# Altium schematic sheet PCB_mezzanine_clock_template.SchDoc: ADC/DAC mezzanine
size 420 x 297 mm; Author: G.K.; CompanyName: WUT; DrawnBy: G.K.; Organization: CERN; Address1: Warsaw Univeristy of Technology; Address2: Nowowiejska 15/19; Revision: -; SheetNumber: -; SheetTotal: -; EDA_Number: ARTIQ; Projet: ADC/DAC MEZZANINE; ModifiedBy: -; CreateDate: XX/XX/XXXX; CheckedDate: -; Title2: Top entity; DivGrp: ISE; Designer: G.K.; ModifiedDate: -; ProjectName: ADC/DAC MEZZANINE
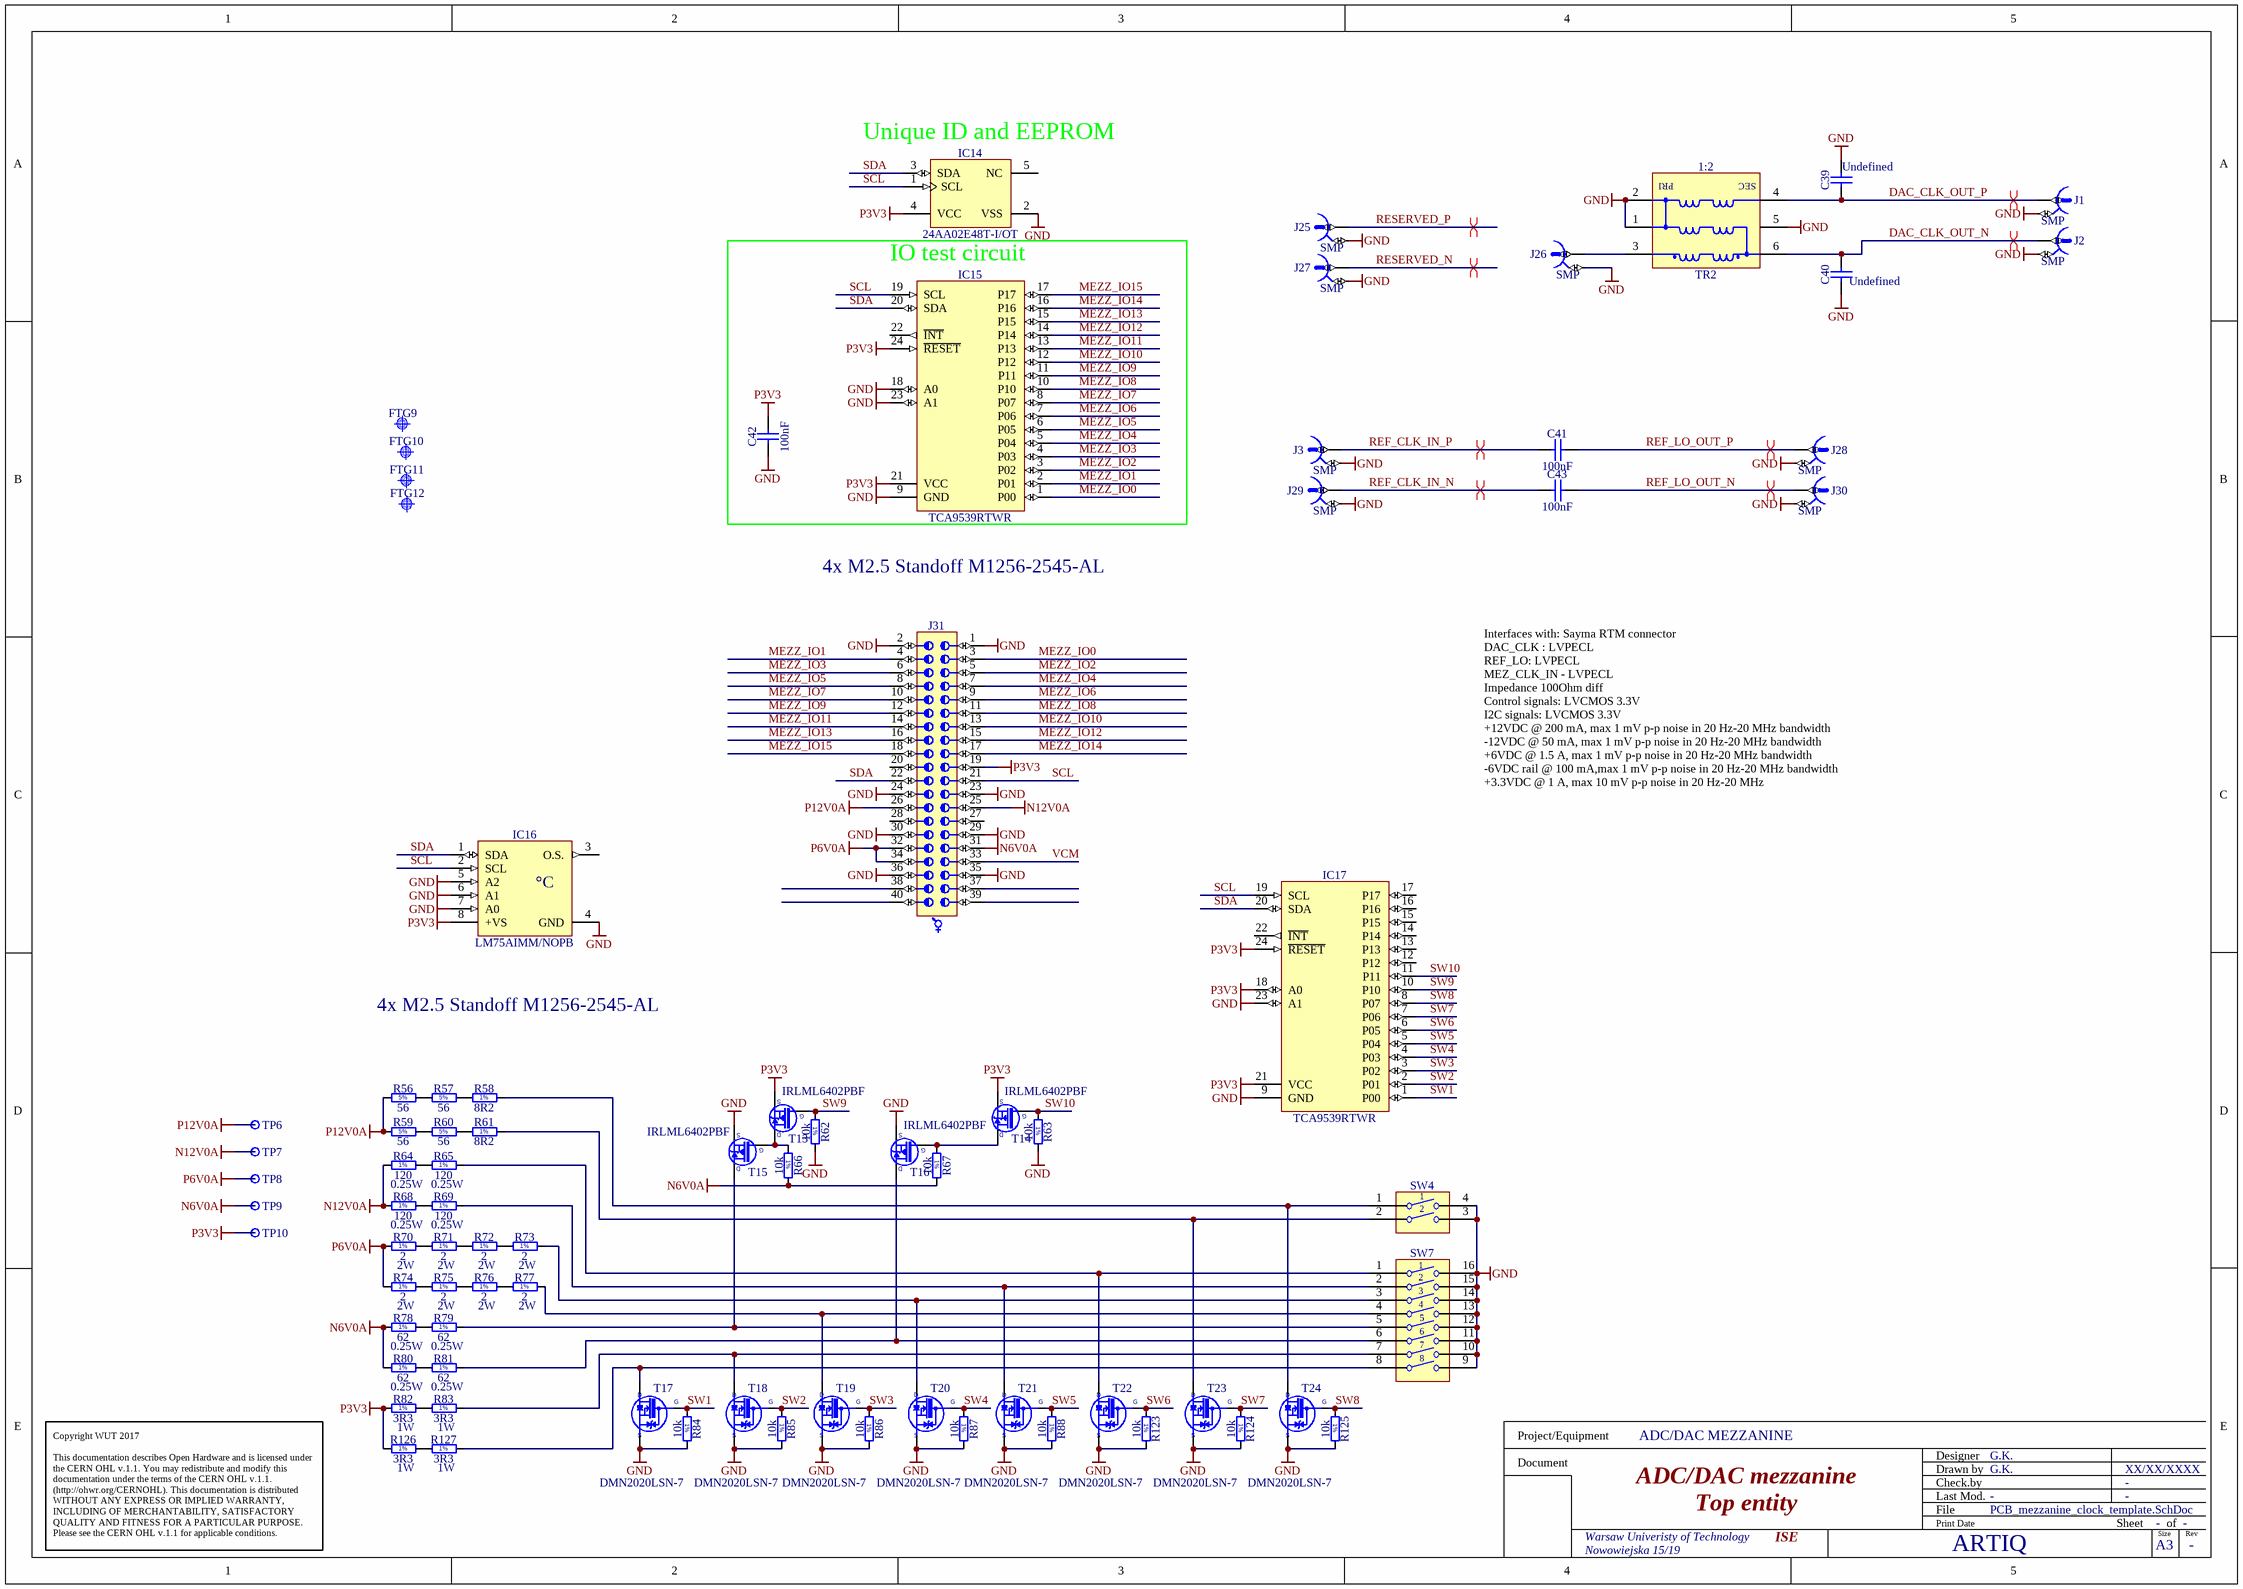
[diagram p0: PCB_mezzanine_clock_template.SchDoc]

## Parts
C39  Undefined  [CAPC1005X55N]
C40  Undefined  [CAPC1005X55N]
C41  100nF  [CAPC1005X55N]
C42  100nF  [CAPC1005X55N]
C43  100nF  [CAPC1005X55N]
FTG9  Use only in PCB  [FIDUCIAL_TOP_C100-200]  (value not drawn)
FTG10  Use only in PCB  [FIDUCIAL_TOP_S100-200]  (value not drawn)
FTG11  Use only in PCB  [FIDUCIAL_TOP_S200-400]  (value not drawn)
FTG12  Use only in PCB  [FIDUCIAL_TOP_S100-200]  (value not drawn)
IC14  24AA02E48T-I/OT  [SOT95P280X145-5N]
IC15  TCA9539RTWR  [QFN50P400X400X80-25N-S255]
IC16  LM75AIMM/NOPB  [SOP65P490X109-8N]
IC17  TCA9539RTWR  [QFN50P400X400X80-25N-S255]
J1  SMP  [MOLEX_85305-0232]
J2  SMP  [MOLEX_85305-0232]
J3  SMP  [MOLEX_85305-0232]
J25  SMP  [MOLEX_85305-0232]
J26  SMP  [MOLEX_73415-3591]
J27  SMP  [MOLEX_85305-0232]
J28  SMP  [MOLEX_85305-0232]
J29  SMP  [MOLEX_85305-0232]
J30  SMP  [MOLEX_85305-0232]
J31  (no value)  [SAMTEC_LSS-120-02-L-DV-A]
R56  56  [RESC6331X70N]
R57  56  [RESC6331X70N]
R58  8R2  [RESC3216X65N]
R59  56  [RESC6331X70N]
R60  56  [RESC6331X70N]
R61  8R2  [RESC3216X65N]
R62  10k  [RESC1005X40N]
R63  10k  [RESC1005X40N]
R64  120  Power: 0.25W  [RESC3216X65N]
R65  120  Power: 0.25W  [RESC3216X65N]
R66  10k  [RESC1005X40N]
R67  10k  [RESC1005X40N]
R68  120  Power: 0.25W  [RESC3216X65N]
R69  120  Power: 0.25W  [RESC3216X65N]
R70  2  Power: 2W  [RESM11670X449N]
R71  2  Power: 2W  [RESM11670X449N]
R72  2  Power: 2W  [RESM11670X449N]
R73  2  Power: 2W  [RESM11670X449N]
R74  2  Power: 2W  [RESM11670X449N]
R75  2  Power: 2W  [RESM11670X449N]
R76  2  Power: 2W  [RESM11670X449N]
R77  2  Power: 2W  [RESM11670X449N]
R78  62  Power: 0.25W  [RESC3216X65N]
R79  62  Power: 0.25W  [RESC3216X65N]
R80  62  Power: 0.25W  [RESC3216X65N]
R81  62  Power: 0.25W  [RESC3216X65N]
R82  3R3  Power: 1W  [RESC6331X70N]
R83  3R3  Power: 1W  [RESC6331X70N]
R84  10k  [RESC1005X40N]
R85  10k  [RESC1005X40N]
R86  10k  [RESC1005X40N]
R87  10k  [RESC1005X40N]
R88  10k  [RESC1005X40N]
R123  10k  [RESC1005X40N]
R124  10k  [RESC1005X40N]
R125  10k  [RESC1005X40N]
R126  3R3  Power: 1W  [RESC6331X70N]
R127  3R3  Power: 1W  [RESC6331X70N]
SW4  Switch  [SW_OMRON_A6S-2102-H]  (value not drawn)
SW7  Switch  [SW_OMRON_A6S-8102-H]  (value not drawn)
T13  IRLML6402PBF  [SOT95P237X112-3N]
T14  IRLML6402PBF  [SOT95P237X112-3N]
T15  IRLML6402PBF  [SOT95P237X112-3N]
T16  IRLML6402PBF  [SOT95P237X112-3N]
T17  DMN2020LSN-7  [SOT95P285X140-3N]
T18  DMN2020LSN-7  [SOT95P285X140-3N]
T19  DMN2020LSN-7  [SOT95P285X140-3N]
T20  DMN2020LSN-7  [SOT95P285X140-3N]
T21  DMN2020LSN-7  [SOT95P285X140-3N]
T22  DMN2020LSN-7  [SOT95P285X140-3N]
T23  DMN2020LSN-7  [SOT95P285X140-3N]
T24  DMN2020LSN-7  [SOT95P285X140-3N]
TP6  Test Point  [TPS127]  (value not drawn)
TP7  Test Point  [TPS127]  (value not drawn)
TP8  Test Point  [TPS127]  (value not drawn)
TP9  Test Point  [TPS127]  (value not drawn)
TP10  Test Point  [TPS127]  (value not drawn)
TR2  1:2  [XFMR_MINI-CIRCUITS_DB1627]

## Blocks framed on the sheet
IO test circuit: C42 IC15

## Nets
GND: C39.2 C40.1 C42.1 IC14.2(VSS) IC15.9(GND) IC15.18(A0) IC15.23(A1) IC16.4(GND) IC16.5(A2) IC16.6(A1) IC16.7(A0) IC17.9(GND) IC17.23(A1) J1.2 J2.2 J3.2 J25.2 J26.2 J27.2 J28.2 J29.2 J30.2 J31.1 J31.2 J31.23 J31.24 J31.29 J31.30 J31.35 J31.36 R62.2 R63.2 R84.2 R85.2 R86.2 R87.2 R88.2 R123.2 R124.2 R125.2 SW4.3 SW4.4 SW7.9 SW7.10 SW7.11 SW7.12 SW7.13 SW7.14 SW7.15 SW7.16 T15.2(S) T16.2(S) T17.2(S) T18.2(S) T19.2(S) T20.2(S) T21.2(S) T22.2(S) T23.2(S) T24.2(S) TR2.1(P1) TR2.2(P1) TR2.5(NC)
N6V0A: J31.31 R66.2 R67.2 R78.1 R80.1 TP9.1
N12V0A: J31.25 R64.1 R68.1 TP7.1
P3V3: C42.2 IC14.4(VCC) IC15.21(VCC) IC15.24(~{RESET}) IC16.8(+VS) IC17.18(A0) IC17.21(VCC) IC17.24(~{RESET}) J31.19 R82.1 R126.1 T13.2(S) T14.2(S) TP10.1
P6V0A: J31.32 J31.34 R70.1 R74.1 TP8.1
P12V0A: J31.26 R56.1 R59.1 TP6.1
DAC_CLK_OUT_N: C40.2 J2.1 TR2.6(S1)
DAC_CLK_OUT_P: C39.1 J1.1 TR2.4(S1)
MEZZ_IO0: IC15.1(P00) J31.3
MEZZ_IO1: IC15.2(P01) J31.4
MEZZ_IO2: IC15.3(P02) J31.5
MEZZ_IO3: IC15.4(P03) J31.6
MEZZ_IO4: IC15.5(P04) J31.7
MEZZ_IO5: IC15.6(P05) J31.8
MEZZ_IO6: IC15.7(P06) J31.9
MEZZ_IO7: IC15.8(P07) J31.10
MEZZ_IO8: IC15.10(P10) J31.11
MEZZ_IO9: IC15.11(P11) J31.12
MEZZ_IO10: IC15.12(P12) J31.13
MEZZ_IO11: IC15.13(P13) J31.14
MEZZ_IO12: IC15.14(P14) J31.15
MEZZ_IO13: IC15.15(P15) J31.16
MEZZ_IO14: IC15.16(P16) J31.17
MEZZ_IO15: IC15.17(P17) J31.18
REF_CLK_IN_N: C43.1 J29.1
REF_CLK_IN_P: C41.1 J3.1
REF_LO_OUT_N: C43.2 J30.1
REF_LO_OUT_P: C41.2 J28.1
RESERVED_N: J27.1
RESERVED_P: J25.1
SCL: IC14.1(SCL) IC15.19(SCL) IC16.2(SCL) IC17.19(SCL) J31.21
SDA: IC14.3(SDA) IC15.20(SDA) IC16.1(SDA) IC17.20(SDA) J31.22
SW1: IC17.1(P00) R84.1 T17.1(G)
SW2: IC17.2(P01) R85.1 T18.1(G)
SW3: IC17.3(P02) R86.1 T19.1(G)
SW4: IC17.4(P03) R87.1 T20.1(G)
SW5: IC17.5(P04) R88.1 T21.1(G)
SW6: IC17.6(P05) R123.1 T22.1(G)
SW7: IC17.7(P06) R124.1 T23.1(G)
SW8: IC17.8(P07) R125.1 T24.1(G)
SW9: IC17.10(P10) R62.1 T13.1(G)
SW10: IC17.11(P11) R63.1 T14.1(G)
VCM: J31.33
NetJ26_1: J26.1 TR2.3(P1)
NetR56_2: R56.2 R57.1
NetR57_2: R57.2 R58.1
NetR58_2: R58.2 SW4.1 T24.3(D)
NetR59_2: R59.2 R60.1
NetR60_2: R60.2 R61.1
NetR61_2: R61.2 SW4.2 T23.3(D)
NetR64_2: R64.2 R65.1
NetR65_2: R65.2 SW7.1 T22.3(D)
NetR66_1: R66.1 T13.3(D) T15.1(G)
NetR67_1: R67.1 T14.3(D) T16.1(G)
NetR68_2: R68.2 R69.1
NetR69_2: R69.2 SW7.2 T21.3(D)
NetR70_2: R70.2 R71.1
NetR71_2: R71.2 R72.1
NetR72_2: R72.2 R73.1
NetR73_2: R73.2 SW7.3 T20.3(D)
NetR74_2: R74.2 R75.1
NetR75_2: R75.2 R76.1
NetR76_2: R76.2 R77.1
NetR77_2: R77.2 SW7.4 T19.3(D)
NetR78_2: R78.2 R79.1
NetR79_2: R79.2 SW7.5 T15.3(D)
NetR80_2: R80.2 R81.1
NetR81_2: R81.2 SW7.6 T16.3(D)
NetR82_2: R82.2 R83.1
NetR83_2: R83.2 SW7.7 T18.3(D)
NetR126_2: R126.2 R127.1
NetR127_2: R127.2 SW7.8 T17.3(D)

Not connected (* = marked no-connect by the designer): IC14 5(NC); IC15 22(~{INT}); IC16 3(O.S.); IC17 12(P12) 13(P13) 14(P14) 15(P15) 16(P16) 17(P17) 22(~{INT}); J31 20 27 28 37 38 39 40

## Layout directives
differential pair: DAC_CLK_OUT_N, DAC_CLK_OUT_P, REF_CLK_IN_N, REF_CLK_IN_P, REF_LO_OUT_N, REF_LO_OUT_P, RESERVED_N, RESERVED_P

## Notes on the sheet
- (near IC14) Unique ID and EEPROM
- 4x M2.5 Standoff M1256-2545-AL
- Interfaces with: Sayma RTM connector
  DAC_CLK : LVPECL
  REF_LO: LVPECL
  MEZ_CLK_IN - LVPECL
  Impedance 100Ohm diff
  Control signals: LVCMOS 3.3V
  I2C signals: LVCMOS 3.3V
  +12VDC @ 200 mA, max 1 mV p-p noise in 20 Hz-20 MHz bandwidth
  -12VDC @ 50 mA, max 1 mV p-p noise in 20 Hz-20 MHz bandwidth
  +6VDC @ 1.5 A, max 1 mV p-p noise in 20 Hz-20 MHz bandwidth
  -6VDC rail @ 100 mA,max 1 mV p-p noise in 20 Hz-20 MHz bandwidth
  +3.3VDC @ 1 A, max 10 mV p-p noise in 20 Hz-20 MHz
- Copyright WUT 2017
  This documentation describes Open Hardware and is licensed under the CERN OHL v.1.1. You may redistribute and modify this documentation under the terms of the CERN OHL v.1.1. (http://ohwr.org/CERNOHL). This documentation is distributed WITHOUT ANY EXPRESS OR IMPLIED WARRANTY, INCLUDING OF MERCHANTABILITY, SATISFACTORY QUALITY AND FITNESS FOR A PARTICULAR PURPOSE. Please see the CERN OHL v.1.1 for applicable conditions.
- Project/Equipment
- Document
- Designer
- Drawn by
- Check.by
- File
- Last Mod.
- Print Date
- Sheet
- Size
- A3
- of
- Rev
- (in symbol LM75AIMM/NOPB) °C
- (in symbol R0402_10K_1%_0.0625W_100PPM) 1%
- (in symbol R1206_8R2_1%_0.25W_200PPM) 1%
- (in symbol R1206_62R_1%_0.25W_100PPM) 1%
- (in symbol R1206_120R_1%_0.25W_100PPM) 1%
- (in symbol R2512_3R3_1%_1W_200PPM) 1%
- (in symbol R2512_56R_5%_1W_200PPM) 5%
- (in symbol R4527_2R_1%_2W_50PPM) 1%
- (in symbol XFMR_MINI-CIRCUITS_TCM2-43X+) PRI; SEC

## Library data of the parts
C39 C40 = CC0402_NO-VALUE: Non-polarised capacitor; Part Description: Reserved Footprint For 0402(1005) Chip Ceramic Capacitor; Mounted: No; Part Number: CC0402_NO-VALUE; Component Kind: Standard; Component Type: Standard; Pin Count: 2; Value: Undefined; Status: None; Manufacturer: Undefined; Manufacturer Part Number: CC0402_NO-VALUE; Case: 0402; Socket: No; SMD: Yes; Sense: No; Manufacturer1 ComponentHeight: 0.55mm; HelpURL: Undefined; Author: CERN DEM JLC; CreateDate: 14.01.2014; LatestRevisionDate: 14.01.2014
C41-C43 = CC0402_100NF_16V_10%_X5R: Non-polarised capacitor; Part Description: SMD Multilayer Chip Ceramic Capacitor; Manufacturer: GENERIC; Manufacturer1 Part Number: GRM155R61C104KA88D; Voltage: 16V; TC: X5R; Tolerance: ±10%; Part Number: CC0402_100NF_16V_10%_X5R; Component Kind: Standard; Component Type: Standard; Pin Count: 2; Value: 100nF; Status: None; Manufacturer Part Number: CC0402_100NF_16V_10%_X5R; Case: 0402; Mounted: Yes; Socket: No; SMD: Yes; Sense: No; Manufacturer1 Example: MURATA; Manufacturer1 ComponentHeight: 0.55mm; HelpURL: \\cern.ch\dfs\Applications\Altium\Datasheets\CC0402_X5R_MURATA_GRM.pdf; Author: CERN DEM JLC; CreateDate: 10.12.2013; LatestRevisionDate: 10.12.2013
FTG9 = FIDUCIAL_TARGET_C100-200: Fiducial Target; Part Description: Round Fiducial Target, Top Layer, 1.0mm, Top Solder 2.0mm, Keepout =2.0mm; Mounted: No; Part Number: FIDUCIAL_TARGET_C100-200; Component Kind: Standard (No BOM); Component Type: Standard (No BOM); Pin Count: 1; Family: Fiducial; Socket: No; SMD: Yes; Sense: No; Status: None; ComponentHeight: 0mm; HelpURL: Undefined; Author: CERN DEM JLC; CreateDate: 09.02.2010; LatestRevisionDate: 04.04.2012; PackageDescription: Round Fiducial Target, Top Layer, 1.0mm, Top Solder 2.0mm, Keepout =2.0mm
FTG10 FTG12 = FIDUCIAL_TARGET_S100-200: Fiducial Target; Part Description: Square Fiducial Target, Top Layer, 1.0mm, Top Solder 2.0mm, Keepout =2.0mm; Mounted: No; Part Number: FIDUCIAL_TARGET_S100-200; Component Kind: Standard (No BOM); Component Type: Standard (No BOM); Pin Count: 1; Family: Fiducial; Socket: No; SMD: Yes; Sense: No; Status: None; ComponentHeight: 0mm; HelpURL: Undefined; Author: CERN DEM JLC; CreateDate: 09.02.2010; LatestRevisionDate: 04.04.2012; PackageDescription: Square Fiducial Target, Top Layer, 1.0mm, Top Solder 2.0mm, Keepout =2.0mm
FTG11 = FIDUCIAL_TARGET_S200-400: Fiducial Target; Part Description: Square Fiducial Target, Top Layer, 2.0mm, Top Solder 4.0mm, Keepout =4.0mm; Mounted: No; Part Number: FIDUCIAL_TARGET_S200-400; Component Kind: Standard (No BOM); Component Type: Standard (No BOM); Pin Count: 1; Family: Fiducial; Socket: No; SMD: Yes; Sense: No; Status: None; ComponentHeight: 0mm; HelpURL: Undefined; Author: CERN DEM JLC; CreateDate: 02.06.2008; LatestRevisionDate: 04.04.2012; PackageDescription: Square Fiducial Target, Top Layer, 2.0mm, Top Solder 4.0mm, Keepout =4.0mm
IC14 = 24AA02E48T-I/OT: 1.7V-5.5V, 2K I2C Serial EEPROM With EUI-48 Node Identity; Manufacturer: MICROCHIP TECHNOLOGY; PressFit: No; Bonding: No; Part Number: 24AA02E48T-I/OT; Component Kind: Standard; Component Type: Standard; Device: 24AA02E48T-I/OT; PackageDescription: SOT, 0.95mm pitch; 5 pin, 1.60mm W X 2.90mm L X 1.45mm H body, IPC Medium Density; Part Description: 1.7V-5.5V, 2K I2C Serial EEPROM With EUI-48 Node Identity; Manufacturer Part Number: 24AA02E48T-I/OT; Pin Count: 5; Case: SOT23-5; Mounted: Yes; Socket: No; SMD: Yes; Sense: No; ComponentHeight: 1.45mm; HelpURL: \\cern.ch\dfs\Applications\Altium\Datasheets\24AA02E48T-I-OT.pdf; Author: CERN DEM MR; CreateDate: 31.03.2016; LatestRevisionDate: 31.03.2016
IC15 IC17 = TCA9539RTWR: Low-Voltage 16-Bit I2C and SMBus I/O Expander; Part Description: Low Voltage 16-Bit I2C and SMBus Low-Power I/O Expander With Interrupt Output, Reset Pin, Configuration Registers; Manufacturer: TEXAS INSTRUMENTS; PressFit: No; Bonding: No; Part Number: TCA9539RTWR; Component Kind: Standard; Component Type: Standard; Device: TCA9539RTWR; PackageDescription: QFN, 0.50mm Pitch, Square; 24 Pin, 4.00mm X 4.00mm X 0.80mm H Body (w/Thermal Tab 2.55 X 2.55 mm), IPC Medium Density; Manufacturer Part Number: TCA9539RTWR; Pin Count: 25; Case: QFN24; Mounted: Yes; Socket: No; SMD: Yes; Sense: No; ComponentHeight: 0.8mm; Author: CERN DEM MR; HelpURL: \\cern.ch\dfs\Applications\Altium\Datasheets\TCA9539RTWR.pdf; CreateDate: 01.12.2015; LatestRevisionDate: 01.12.2015
IC16 = LM75AIMM/NOPB: Digital Temperature Sensor and Thermal Watchdog with Two-Wire Interface; Part Description: -25° to +100°C ±2°C Digital Temperature Sensor and Thermal Watchdog with Two-Wire Interface; Manufacturer: TEXAS INSTRUMENTS; PressFit: No; Bonding: No; Part Number: LM75AIMM/NOPB; Component Kind: Standard; Component Type: Standard; Device: LM75AIMM/NOPB; PackageDescription: SOP, 0.65mm pitch; 8 pin,3.00mm W X 3.00mm L X 1.09mm H bodyI, PC Medium Density; Manufacturer Part Number: LM75AIMM/NOPB; Pin Count: 8; Case: SSOP8; Mounted: Yes; Socket: No; SMD: Yes; Sense: No; ComponentHeight: 1.09mm; HelpURL: \\cern.ch\dfs\Applications\Altium\Datasheets\LM75AIMM-NOPB.pdf; Author: CERN DEM JLC; CreateDate: 15.10.2012; LatestRevisionDate: 15.10.2012
J1-J3 J25 J27-J30 = MOLEX_85305-0232: Part Description: 50 Ohms, SMP Surface Mount Plug, Limited Detent; Manufacturer: MOLEX; PressFit: No; Part Number: MOLEX_85305-0232; Component Kind: Standard; Component Type: Standard; Pin Count: 2; Family: SMP; Mounted: Yes; Socket: No; SMD: Yes; Sense: No; Status: None; Manufacturer Part Number: 85305-0232; ComponentHeight: 4.1mm; HelpURL: \\cern.ch\dfs\Applications\Altium\Datasheets\MOLEX_85305-0232.pdf; Author: CERN DEM JMW; CreateDate: 09.08.2016; LatestRevisionDate: 09.08.2016
J26 = MOLEX_73415-3591: Part Description: 50 Ohms, SMP Edge Mount PCB Plug, Leg Length 1.27mm; Manufacturer: MOLEX; PressFit: No; Part Number: MOLEX_73415-3591; Component Kind: Standard; Component Type: Standard; Pin Count: 2; Family: SMP; Mounted: Yes; Socket: No; SMD: Yes; Sense: No; Status: None; Manufacturer Part Number: 73415-3591; ComponentHeight: 4.34mm; HelpURL: \\cern.ch\dfs\Applications\Altium\Datasheets\MOLEX_73415-3591.pdf; Author: CERN DEM JMW; CreateDate: 09.08.2016; LatestRevisionDate: 09.08.2016
J31 = CON_SAMTEC_LSS-120-02-L-DV-A: 40 Contacts, Pitch 0.635mm, Razor Beam LSS Vertical High Speed Hermaphroditic Strip (Lead Style 7.49mm); Part Description: 40 Contacts, Pitch 0.635mm, Razor Beam LSS Vertical High Speed Hermaphroditic Strip (Lead Style 5.49mm); Manufacturer: SAMTEC; PressFit: No; Part Number: SAMTEC_LSS-120-02-L-DV-A; Component Kind: Standard; Component Type: Standard; Pin Count: 40; Mounted: Yes; Socket: No; Sense: No; SMD: Yes; Status: None; Manufacturer Part Number: LSS-120-02-L-DV-A; ComponentHeight: 5.57mm; HelpURL: \\cern.ch\dfs\Applications\Altium\Datasheets\SAMTEC_LSS-120-03-L-DV-A.pdf; Author: CERN DEM JMW; CreateDate: 10.11.2015; LatestRevisionDate: 10.11.2015
R56 R57 R59 R60 = R2512_56R_5%_1W_200PPM: Resistor - 5%; Part Description: Surface Mount Power Resistor; Manufacturer: GENERIC; Manufacturer1 Part Number: 352056RJT; Power: 1W; TC: ±200ppm/°C; Part Number: R2512_56R_5%_1W_200PPM; Component Kind: Standard; Component Type: Standard; Pin Count: 2; Value: 56; Status: None; Tolerance: ±5%; Manufacturer Part Number: R2512_56R_5%_1W_200PPM; Case: 2512; Mounted: Yes; Sense: No; Socket: No; SMD: Yes; Manufacturer1 Example: TYCO ELECTRONICS; Manufacturer1 ComponentHeight: 0.7mm; HelpURL: \\cern.ch\dfs\Applications\Altium\Datasheets\R2512_TYCO_3520.pdf; Author: CERN DEM JLC; CreateDate: 21.07.2010; LatestRevisionDate: 21.07.2010
R58 R61 = R1206_8R2_1%_0.25W_200PPM: Resistor - 1%; Part Description: General Purpose Thick Film Chip Resistor; Manufacturer: GENERIC; Manufacturer1 Part Number: 232272468208; Power: 0.25W; TC: ±200ppm/°C; Part Number: R1206_8R2_1%_0.25W_200PPM; Component Kind: Standard; Component Type: Standard; Pin Count: 2; Value: 8R2; Status: Preferred; Tolerance: ±1%; Manufacturer Part Number: R1206_8R2_1%_0.25W_200PPM; Case: 1206; Mounted: Yes; Sense: No; Socket: No; SMD: Yes; Manufacturer1 Example: PHYCOMP; Manufacturer1 ComponentHeight: 0.65mm; HelpURL: \\cern.ch\dfs\Applications\Altium\Datasheets\R1206_Phycomp_RC1206.pdf; Author: CERN DEM JLC; CreateDate: 03.12.2007; LatestRevisionDate: 24.06.2009
R62 R63 R66 R67 R84-R88 R123-R125 = R0402_10K_1%_0.0625W_100PPM: Resistor - 1%; Part Description: General Purpose Thick Film Chip Resistor; Manufacturer: GENERIC; Manufacturer1 Part Number: 232270671003L; TC: ±100ppm/°C; Part Number: R0402_10K_1%_0.0625W_100PPM; Component Kind: Standard; Component Type: Standard; Pin Count: 2; Value: 10k; Status: Not recommended; Power: 0.0625W; Tolerance: ±1%; Manufacturer Part Number: R0402_10K_1%_0.0625W_100PPM; Case: 0402; Mounted: Yes; Sense: No; Socket: No; SMD: Yes; Manufacturer1 Example: YAGEO PHYCOMP; Manufacturer1 ComponentHeight: 0.4mm; HelpURL: \\cern.ch\dfs\Applications\Altium\Datasheets\R0402_Phycomp_RC0402.pdf; Author: CERN DEM JLC; CreateDate: 03.12.2007; LatestRevisionDate: 17.10.2012
R64 R65 R68 R69 = R1206_120R_1%_0.25W_100PPM: Resistor - 1%; Part Description: General Purpose Thick Film Chip Resistor; Manufacturer: GENERIC; Manufacturer1 Part Number: NRC12F1200TRF; TC: ±100ppm/°C; Part Number: R1206_120R_1%_0.25W_100PPM; Component Kind: Standard; Component Type: Standard; Pin Count: 2; Value: 120; Status: Preferred; Tolerance: ±1%; Manufacturer Part Number: R1206_120R_1%_0.25W_100PPM; Case: 1206; Mounted: Yes; Sense: No; Socket: No; SMD: Yes; Manufacturer1 Example: NIC COMPONENT; Manufacturer1 ComponentHeight: 0.65mm; HelpURL: \\cern.ch\dfs\Applications\Altium\Datasheets\R1206_NIC_NRC.pdf; Author: CERN DEM JLC; CreateDate: 03.12.2007; LatestRevisionDate: 13.03.2008
R70-R77 = R4527_2R_1%_2W_50PPM: Resistor - 1%; Part Description: Surface Mount Precision Power Wirewound Resistor; Manufacturer: VISHAY DALE; Manufacturer Part Number: WSC45272R000FEA; TC: ±50ppm/°C; Part Number: R4527_2R_1%_2W_50PPM; Component Kind: Standard; Component Type: Standard; Pin Count: 2; Value: 2; Status: None; Tolerance: ±1%; Case: 4527; Mounted: Yes; Sense: No; Socket: No; SMD: Yes; ComponentHeight: 4.49mm; HelpURL: \\cern.ch\dfs\Applications\Altium\Datasheets\R4527_VISHAY_WSC.pdf; Author: CERN DEM JLC; CreateDate: 22.03.2011; LatestRevisionDate: 22.03.2011
R78-R81 = R1206_62R_1%_0.25W_100PPM: Resistor - 1%; Part Description: General Purpose Thick Film Chip Resistor; Manufacturer: GENERIC; Manufacturer1 Part Number: NRC12F62R0TRF; TC: ±100ppm/°C; Part Number: R1206_62R_1%_0.25W_100PPM; Component Kind: Standard; Component Type: Standard; Pin Count: 2; Value: 62; Status: Preferred; Tolerance: ±1%; Manufacturer Part Number: R1206_62R_1%_0.25W_100PPM; Case: 1206; Mounted: Yes; Sense: No; Socket: No; SMD: Yes; Manufacturer1 Example: NIC COMPONENT; Manufacturer1 ComponentHeight: 0.65mm; HelpURL: \\cern.ch\dfs\Applications\Altium\Datasheets\R1206_NIC_NRC.pdf; Author: CERN DEM JLC; CreateDate: 03.12.2007; LatestRevisionDate: 13.03.2008
R82 R83 R126 R127 = R2512_3R3_1%_1W_200PPM: Resistor - 1%; Part Description: Thick Film Chip Resistor; Manufacturer: GENERIC; Manufacturer1 Part Number: 232276363308L or RC2512FK-073R3L; TC: ±200ppm/°C; Part Number: R2512_3R3_1%_1W_200PPM; Component Kind: Standard; Component Type: Standard; Pin Count: 2; Value: 3R3; Status: Preferred; Tolerance: ±1%; Manufacturer Part Number: R2512_3R3_1%_1W_200PPM; Case: 2512; Mounted: Yes; Sense: No; Socket: No; SMD: Yes; Manufacturer1 Example: YAGEO PHYCOMP; Manufacturer1 ComponentHeight: 0.65mm; HelpURL: \\cern.ch\dfs\Applications\Altium\Datasheets\R2512_Phycomp_RC2512.pdf; Author: CERN DEM JLC; CreateDate: 21.07.2008; LatestRevisionDate: 17.10.2012
SW4 = SW_OMRON_A6S-2102-H: 2 Ways SPST DIP Switch; Part Description: 2 Ways SPST DIP Switch, White Flat Actuator with Seal Tape, Contact Rating 25mA 24VDC; Manufacturer: OMRON; PressFit: No; Part Number: SW_OMRON_A6S-2102-H; Component Kind: Standard; Component Type: Standard; Pin Count: 4; PackageDescription: Pitch 2.54mm, Body 6.2x6.4mm, 2 Ways SPST Surface-Mounting DIP Switch, OMRON A6S-H; Family: Switch; Mounted: Yes; Socket: No; SMD: Yes; Sense: No; Status: None; Manufacturer Part Number: A6S-2102-H; ComponentHeight: 3.8mm; HelpURL: \\cern.ch\dfs\Applications\Altium\Datasheets\SW_OMRON_A6S-2102-H.pdf; Author: CERN DEM JMW; CreateDate: 25.09.2008; LatestRevisionDate: 25.09.2008
SW7 = SW_OMRON_A6S-8102-H: 8 Ways SPST DIP Switch; Part Description: 8 Ways SPST DIP Switch, White Flat Actuator with Seal Tape, Contact Rating 25mA 24VDC; Manufacturer: OMRON; PressFit: No; Part Number: SW_OMRON_A6S-8102-H; Component Kind: Standard; Component Type: Standard; Pin Count: 16; PackageDescription: Pitch 2.54mm, Body 21.5x6.4mm, 8 Ways SPST Surface-Mounting DIP Switch, OMRON A6S-H; Family: Switch; Mounted: Yes; Socket: No; SMD: Yes; Sense: No; Status: None; Manufacturer Part Number: A6S-8102-H; ComponentHeight: 3.8mm; HelpURL: \\cern.ch\dfs\Applications\Altium\Datasheets\SW_OMRON_A6S-8102-H.pdf; Author: CERN DEM JMW; CreateDate: 25.09.2008; LatestRevisionDate: 25.09.2008
T13-T16 = IRLML6402PBF: P-CHANNEL MOSFET WITH ZENER DIODE; Part Description: -20V -3.7A P-Channel HEXFET® Power MOSFET; Manufacturer: INTERNATIONAL RECTIFIER; PressFit: No; Bonding: No; Part Number: IRLML6402PBF; Component Kind: Standard; Component Type: Standard; Device: IRLML6402PBF; PackageDescription: SOT, 0.95mm, pitch; 3 pin,1.30mm W X 2.92mm L X 1.12mm H body, IPC Medium Density; Manufacturer Part Number: IRLML6402PBF; Pin Count: 3; Case: SOT23-3; Mounted: Yes; Socket: No; SMD: Yes; Sense: No; ComponentHeight: 1.12mm; HelpURL: \\cern.ch\dfs\Applications\Altium\Datasheets\IRLML6402PBF.pdf; Author: CERN DEM JLC; CreateDate: 29.08.2011; LatestRevisionDate: 29.08.2011
T17-T24 = DMN2020LSN-7: 20V, 6.9A, N-Channel Enhancement Mode MOSFET; Manufacturer: DIODES INCORPORATED; PressFit: No; Bonding: No; Part Number: DMN2020LSN-7; Component Kind: Standard; Component Type: Standard; Device: DMN2020LSN-7; PackageDescription: SOT23, 0.95mm Pitch; 3 Pin, 1.6mm W X 3mm L X 1.4mm H Body, IPC Medium Density; Part Description: 20V, 6.9A, N-Channel Enhancement Mode MOSFET; Manufacturer Part Number: DMN2020LSN-7; Pin Count: 3; Case: SOT23-3; Mounted: Yes; Socket: No; SMD: Yes; Sense: No; ComponentHeight: 1.15mm; HelpURL: \\cern.ch\dfs\Applications\Altium\Datasheets\DMN2020LSN-7.pdf; Author: CERN DEM JLC; CreateDate: 17.11.2014; LatestRevisionDate: 19.11.2014
TP6-TP10 = SMD_PAD_1.27X1.27MM: Part Description: 1.27mm x 1.27mm PCB Copper Area (SMD Test Point); Mounted: No; Part Number: SMD_PAD_1.27X1.27MM; Component Kind: Standard (No BOM); Component Type: Standard (No BOM); Pin Count: 1; Family: Test Point; Socket: No; SMD: Yes; Sense: No; Status: None; ComponentHeight: 0mm; HelpURL: Undefined; Author: CERN DEM JLC; CreateDate: 12.01.2008; LatestRevisionDate: 12.01.2008; PackageDescription: 1.27mm x 1.27mm PCB Copper Area (SMD Test Point)
TR2 = XFMR_MINI-CIRCUITS_TCM2-43X+: 50 OHMS 10 to 4000 MHz RF Transformer; Power: 0.4W; Part Number: XFMR_MINI-CIRCUITS_TCM2-43X+; Component Kind: Standard; Component Type: Standard; Pin Count: 6; Value: 1:2; Status: None; Part Description: 50 Ohms 10 to 4000MHz RF Transformer; Manufacturer: MINI-CIRCUITS; Manufacturer Part Number: TCM2-43X+; Mounted: Yes; Socket: No; Sense: No; SMD: Yes; ComponentHeight: 4.06mm; HelpURL: \\cern.ch\dfs\Applications\Altium\Datasheets\XFMR_MINI-CIRCUITS_TCM2-43X+.pdf; Author: CERN DEM BC; CreateDate: 12.02.2016; LatestRevisionDate: 12.02.2016